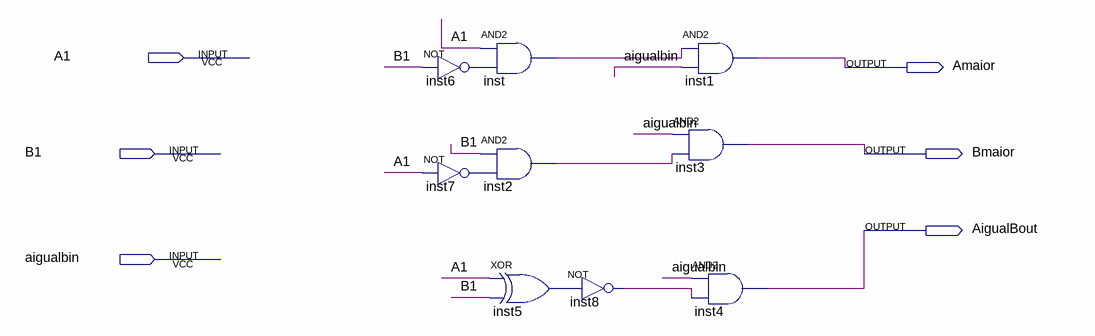
[diagram p0: schematic sheet]
// Quartus schematic compt1bit.bdf as structural Verilog: 9 symbols, 6 pins
module compt1bit (
  input  A1,
  input  B1,
  input  aigualbin,
  output Amaior,
  output Bmaior,
  output AigualBout
);

  wire inst2_out, inst5_out, inst6_out, inst7_out, inst8_out, inst_out;

  not inst6 (inst6_out, B1);
  not inst7 (inst7_out, A1);
  and inst (inst_out, A1, inst6_out);
  and inst2 (inst2_out, B1, inst7_out);
  xor inst5 (inst5_out, A1, B1);
  not inst8 (inst8_out, inst5_out);
  and inst1 (Amaior, inst_out, aigualbin);
  and inst3 (Bmaior, aigualbin, inst2_out);
  and inst4 (AigualBout, aigualbin, inst8_out);
endmodule
